# Altium schematic sheet STM32F446RET6.SchDoc
size A4; SheetNumber: 10; SheetTotal: 31
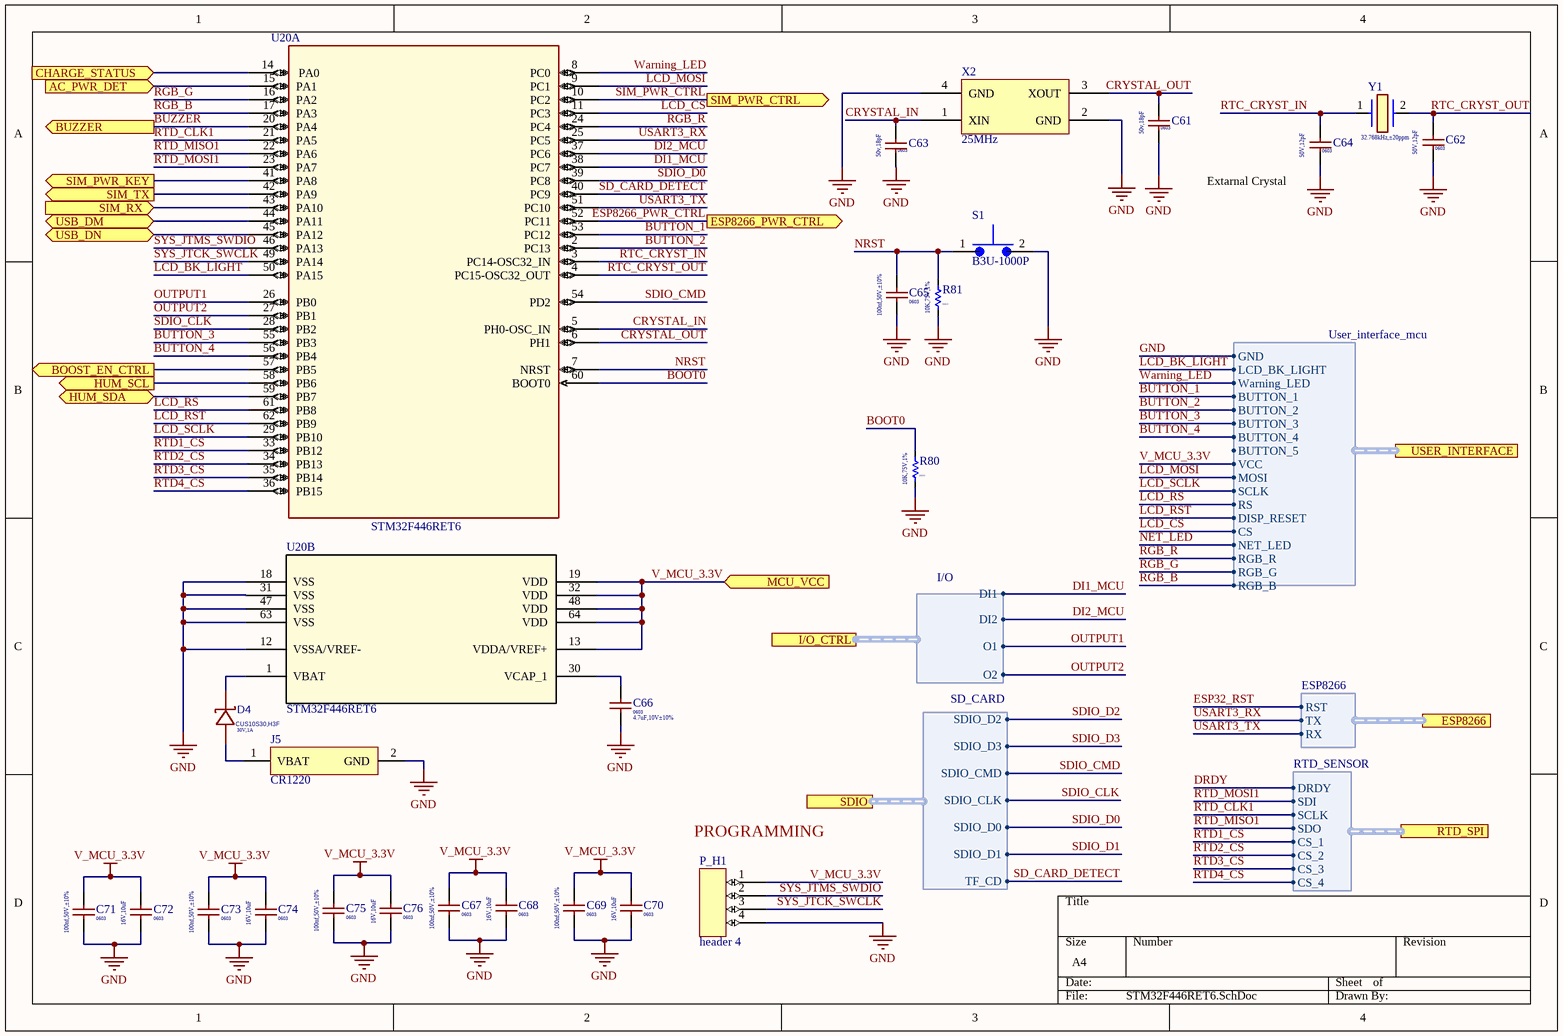
[diagram p0: STM32F446RET6.SchDoc]

## Parts
C61  value 50v,18pF  Package: 0603  [CAPC1608X90N]  (hidden comment: 18pF)
C62  value 50V,12pF  Package: 0603  [CAPC1608X90N]  (hidden comment: 12pF)
C63  value 50v,18pF  Package: 0603  [CAPC1608X90N]  (hidden comment: 18pF)
C64  value 50V,12pF  Package: 0603  [CAPC1608X90N]  (hidden comment: 12pF)
C65  value 100nf,50V,±10%  Package: 0603  [C0603]  (hidden comment: CC0603KRX7R9BB104)
C66  value 4.7uF,10V±10%  Package: 0603  [C0603]  (hidden comment: 4.7uf)
C67  value 100nf,50V,±10%  Package: 0603  [C0603]  (hidden comment: CC0603KRX7R9BB104)
C68  value 16V,10uF  Package: 0603  [CAPC1608X90N]  (hidden comment: 10uf)
C69  value 100nf,50V,±10%  Package: 0603  [C0603]  (hidden comment: CC0603KRX7R9BB104)
C70  value 16V,10uF  Package: 0603  [CAPC1608X90N]  (hidden comment: 10uf)
C71  value 100nf,50V,±10%  Package: 0603  [C0603]  (hidden comment: CC0603KRX7R9BB104)
C72  value 16V,10uF  Package: 0603  [CAPC1608X90N]  (hidden comment: 10uf)
C73  value 100nf,50V,±10%  Package: 0603  [C0603]  (hidden comment: CC0603KRX7R9BB104)
C74  value 16V,10uF  Package: 0603  [CAPC1608X90N]  (hidden comment: 10uf)
C75  value 100nf,50V,±10%  Package: 0603  [C0603]  (hidden comment: CC0603KRX7R9BB104)
C76  value 16V,10uF  Package: 0603  [CAPC1608X90N]  (hidden comment: 10uf)
D4  CUS10S30,H3F  value 30V,1A  [SOD-323]
J5  CR1220  [CR1220 SMD]
P_H1  header 4  [pin header 4]
R80  Package: 0603  [R0603]  (hidden comment: 10K,75V,1%)
R81  Package: 0603  [R0603]  (hidden comment: 10K,75V,1%)
S1  B3U-1000P  [B3U-1000P]
U20  STM32F446RET6  [QFP50P1200X1200X160-64N]  (parts A,B of 2)
X2  25MHz  [SMD Crystal]
Y1  value 32.768kHz,±20ppm  [SMD3215-2P]  (hidden comment: 32.768kHz)

## Ports
AC_PWR_DET (in), BOOST_EN_CTRL (out), BUZZER (out), CHARGE_STATUS (in), ESP8266 (harness ESP8266), ESP8266_PWR_CTRL (out), HUM_SCL (out), HUM_SDA (bidir), I/O_CTRL (harness I/O), MCU_VCC (in), RTD_SPI (harness RTD_SENSOR), SDIO (harness SD_CARD), SIM_PWR_CTRL (out), SIM_PWR_KEY (out), SIM_RX (in), SIM_TX (out), USB_DM (bidir), USB_DN (bidir), USER_INTERFACE (harness User_interface_mcu)

## Harnesses
RTD_SENSOR: DRDY, SDI, SCLK, CS_1, CS_2, CS_3, CS_4, SDO
SD_CARD: SDIO_D2, SDIO_D3, SDIO_CMD, SDIO_CLK, SDIO_D0, SDIO_D1, TF_CD
ESP8266: RST, TX, RX
User_interface_mcu: GND, LCD_BK_LIGHT, BUTTON_1, Warning_LED, BUTTON_2, BUTTON_3, BUTTON_4, BUTTON_5, VCC, MOSI, SCLK, RS, DISP_RESET, CS, NET_LED, RGB_R, RGB_G, RGB_B
I/O: DI1, DI2, O1, O2

## Nets
GND: C61.1 C62.1 C63.1 C64.1 C65.1 C66.1 C67.1 C68.1 C69.1 C70.1 C71.1 C72.1 C73.1 C74.1 C75.1 C76.1 J5.2(GND) P_H1.4 R80.2 R81.2 S1.2 U20.12(VSSA/VREF-) U20.18(VSS) U20.31(VSS) U20.47(VSS) U20.63(VSS) X2.2(GND) X2.4(GND) ; port USER_INTERFACE.GND
V_MCU_3.3V: C67.2 C68.2 C69.2 C70.2 C71.2 C72.2 C73.2 C74.2 C75.2 C76.2 P_H1.1 U20.13(VDDA/VREF+) U20.19(VDD) U20.32(VDD) U20.48(VDD) U20.64(VDD) ; port MCU_VCC, port USER_INTERFACE.VCC
AC_PWR_DET: U20.15(PA1) ; port AC_PWR_DET
BOOST_EN_CTRL: U20.57(PB5) ; port BOOST_EN_CTRL
BOOT0: R80.1 U20.60(BOOT0)
BUTTON_1: U20.53(PC12) ; port USER_INTERFACE.BUTTON_1
BUTTON_2: U20.2(PC13) ; port USER_INTERFACE.BUTTON_2
BUTTON_3: U20.55(PB3) ; port USER_INTERFACE.BUTTON_3
BUTTON_4: U20.56(PB4) ; port USER_INTERFACE.BUTTON_4
BUZZER: U20.20(PA4) ; port BUZZER
CHARGE_STATUS: U20.14(PA0) ; port CHARGE_STATUS
CRYSTAL_IN: C63.2 U20.5(PH0-OSC_IN) X2.1(XIN)
CRYSTAL_OUT: C61.2 U20.6(PH1) X2.3(XOUT)
DI1_MCU: U20.38(PC7) ; port I/O_CTRL.DI1
DI2_MCU: U20.37(PC6) ; port I/O_CTRL.DI2
DRDY: port RTD_SPI.DRDY
ESP32_RST: port ESP8266.RST
ESP8266_PWR_CTRL: U20.52(PC11) ; port ESP8266_PWR_CTRL
HUM_SCL: U20.58(PB6) ; port HUM_SCL
HUM_SDA: U20.59(PB7) ; port HUM_SDA
LCD_BK_LIGHT: U20.50(PA15) ; port USER_INTERFACE.LCD_BK_LIGHT
LCD_CS: U20.11(PC3) ; port USER_INTERFACE.CS
LCD_MOSI: U20.9(PC1) ; port USER_INTERFACE.MOSI
LCD_RS: U20.61(PB8) ; port USER_INTERFACE.RS
LCD_RST: U20.62(PB9) ; port USER_INTERFACE.DISP_RESET
LCD_SCLK: U20.29(PB10) ; port USER_INTERFACE.SCLK
NET_LED: port USER_INTERFACE.NET_LED
NRST: C65.2 R81.1 S1.1 U20.7(NRST)
OUTPUT1: U20.26(PB0) ; port I/O_CTRL.O1
OUTPUT2: U20.27(PB1) ; port I/O_CTRL.O2
RGB_B: U20.17(PA3) ; port USER_INTERFACE.RGB_B
RGB_G: U20.16(PA2) ; port USER_INTERFACE.RGB_G
RGB_R: U20.24(PC4) ; port USER_INTERFACE.RGB_R
RTC_CRYST_IN: C64.2 U20.3(PC14-OSC32_IN) Y1.1(CRYSTAL_2)
RTC_CRYST_OUT: C62.2 U20.4(PC15-OSC32_OUT) Y1.2
RTD1_CS: U20.33(PB12) ; port RTD_SPI.CS_1
RTD2_CS: U20.34(PB13) ; port RTD_SPI.CS_2
RTD3_CS: U20.35(PB14) ; port RTD_SPI.CS_3
RTD4_CS: U20.36(PB15) ; port RTD_SPI.CS_4
RTD_CLK1: U20.21(PA5) ; port RTD_SPI.SCLK
RTD_MISO1: U20.22(PA6) ; port RTD_SPI.SDO
RTD_MOSI1: U20.23(PA7) ; port RTD_SPI.SDI
SD_CARD_DETECT: U20.40(PC9) ; port SDIO.TF_CD
SDIO_CLK: U20.28(PB2) ; port SDIO.SDIO_CLK
SDIO_CMD: U20.54(PD2) ; port SDIO.SDIO_CMD
SDIO_D0: U20.39(PC8) ; port SDIO.SDIO_D0
SDIO_D1: port SDIO.SDIO_D1
SDIO_D2: port SDIO.SDIO_D2
SDIO_D3: port SDIO.SDIO_D3
SIM_PWR_CTRL: U20.10(PC2) ; port SIM_PWR_CTRL
SIM_PWR_KEY: U20.41(PA8) ; port SIM_PWR_KEY
SIM_RX: U20.43(PA10) ; port SIM_RX
SIM_TX: U20.42(PA9) ; port SIM_TX
SYS_JTCK_SWCLK: P_H1.3 U20.49(PA14)
SYS_JTMS_SWDIO: P_H1.2 U20.46(PA13)
USART3_RX: U20.25(PC5) ; port ESP8266.TX
USART3_TX: U20.51(PC10) ; port ESP8266.RX
USB_DM: U20.44(PA11) ; port USB_DM
USB_DN: U20.45(PA12) ; port USB_DN
Warning_LED: U20.8(PC0) ; port USER_INTERFACE.Warning_LED
NetC66_2: C66.2 U20.30(VCAP_1)
NetD4_1: D4.1(K) U20.1(VBAT)
NetD4_2: D4.2(A) J5.1(VBAT)

## Notes on the sheet
- (near C64) Extarnal Crystal
- (near P_H1) PROGRAMMING

## Library data of the parts
C61 C63 = CC0603JRNPO9BN180: 50V 18pF NP0 ±5% 0603 Multilayer Ceramic Capacitors MLCC - SMD/SMT ROHS; Manufacturer: YAGEO; LCSC: C107040; Datasheet: https://www.lcsc.com/datasheet/lcsc_datasheet_2304140030_YAGEO-CC0603JRNPO9BN180_C107040.pdf; MPN: CC0603JRNPO9BN180
C62 C64 = 0603CG120J500NT: 50V 12pF C0G ±5% 0603 Multilayer Ceramic Capacitors MLCC - SMD/SMT ROHS; Manufacturer: FH; Datasheet: https://datasheet.lcsc.com/lcsc/2304140030_FH--Guangdong-Fenghua-Advanced-Tech-0603CG120J500NT_C1642.pdf; LCSC: C1642; MPN: 0603CG120J500NT
C65 C67 C69 C71 C73 C75 = CC0603KRX7R9BB104: 50V 100nF X7R ±10% 0603 Multilayer Ceramic Capacitors MLCC - SMD/SMT ROHS; MPN: 603-CC603KRX7R9BB104; Manufacturer: KEMET; Max Operating Temp: 35 °C; Min Operating Temp: 15 °C; Datasheet: http://componentsearchengine.com/Datasheets/3/CC0603KRX7R9BB104.pdf; LCSC: C14663
C66 = 0603B475K100NT: 10V 4.7uF X7R ±10% 0603 Multilayer Ceramic Capacitors MLCC - SMD/SMT ROHS; MPN: CL10A475KQ8NNNC; Manufacturer: Samsung Electro-Mechanics; Datasheet: https://lcsc.componentsearchengine.com/Datasheets/2/CL10A475KQ8NNNC.pdf
C68 C70 C72 C74 C76 = 0603F106M160NT: 16V 10uF Y5V ±20% 0603 Multilayer Ceramic Capacitors MLCC - SMD/SMT ROHS; Manufacturer: KEMET; MPN: CC0603KRX7R9BB104; Datasheet: http://componentsearchengine.com/Datasheets/3/CC0603KRX7R9BB104.pdf; LCSC: C48906
D4 = CUS10S30,H3F: Diode 30 V 1A Schottky Barrier Diodes Surface Mount USC; Manufacturer: TOSHIBA; MPN: CUS10S30,H3F; LCSC: C146335; Datasheet: https://datasheet.lcsc.com/lcsc/1810181811_TOSHIBA-CUS10S30-H3F_C146335.pdf; Package: SC-76(SOD-323)
J5 = CR1220: Manufacturer: Q&J; Datasheet: https://datasheet.lcsc.com/lcsc/1811061932_Q-J-CR1220-2_C70381.pdf; LCSC: C70381
P_H1 = header 4: Straight 2.54mm 6mm -40℃~+105℃ 1 3mm 4 2.54mm Black Brass 1x4P Straight,P=2.54mm Pin Headers ROHS
R80 R81 = 0603WAF1002T5E: 100mW Thick Film Resistors ±100ppm/℃ ±1% 10kΩ 0603 Chip Resistor - Surface Mount ROHS; Manufacturer: UNI-ROYAL(Uniroyal Elec); Max Operating Temp: 155℃; Min Operating Temp: -55℃; MPN: 0603WAF1002T5E; Datasheet: https://datasheet.lcsc.com/szlcsc/Uniroyal-Elec-0603WAF1002T5E_C25804.pdf; LCSC: C25804; Value: 10K,75V,1%
S1 = B3U-1000P: 2.5mm 1.6mm Round Button 50mA Brick nogging 3mm SPST 153gf 12V SMD,2.5x3mm Tactile Switches ROHS; Manufacturer: Omron Electronics; MPN: 653-B3U-1000P; Datasheet: https://www.omron.com/ecb/products/pdf/en-b3u.pdf; LCSC: C231329
U20 = STM32F446RET6: IC MCU 32BIT 512KB FLASH 64LQFP; Manufacturer: STMicroelectronics; MPN: STM32F446RET6; Package: LQFP-64(10x10); LCSC: C69336; Datasheet: https://www.lcsc.com/datasheet/lcsc_datasheet_2410010204_STMicroelectronics-STM32F446RET6_C69336.pdf; Operating Temperature: -40°C ~ 85°C
X2 = 3TJ425000XYFBC: 25MHz 18pF ±10ppm ±30ppm SMD3225-4P Crystals ROHS; Manufacturer: JYJE; MPN: 3TJ425000XYFBC; Package: SMD3225-4P; Datasheet: https://www.lcsc.com/datasheet/lcsc_datasheet_2304140030_JYJE-3TJ425000XYFBC_C2149071.pdf; LCSC: C2149071
Y1 = Q13FC1350000400: 32.768kHz SMD Crystal Resonator 12.5pF 70kΩ ±20ppm -40℃~+85℃ SMD3215-2P Crystals ROHS; Manufacturer: Seiko Epson; MPN: Q13FC1350000400; Datasheet: https://datasheet.lcsc.com/lcsc/1810171817_Seiko-Epson-Q13FC13500004_C32346.pdf; Package: SMD3215-2P; LCSC: C32346